# EAGLE design 6502_C64_with_6526 (EAGLE 9.2.0)
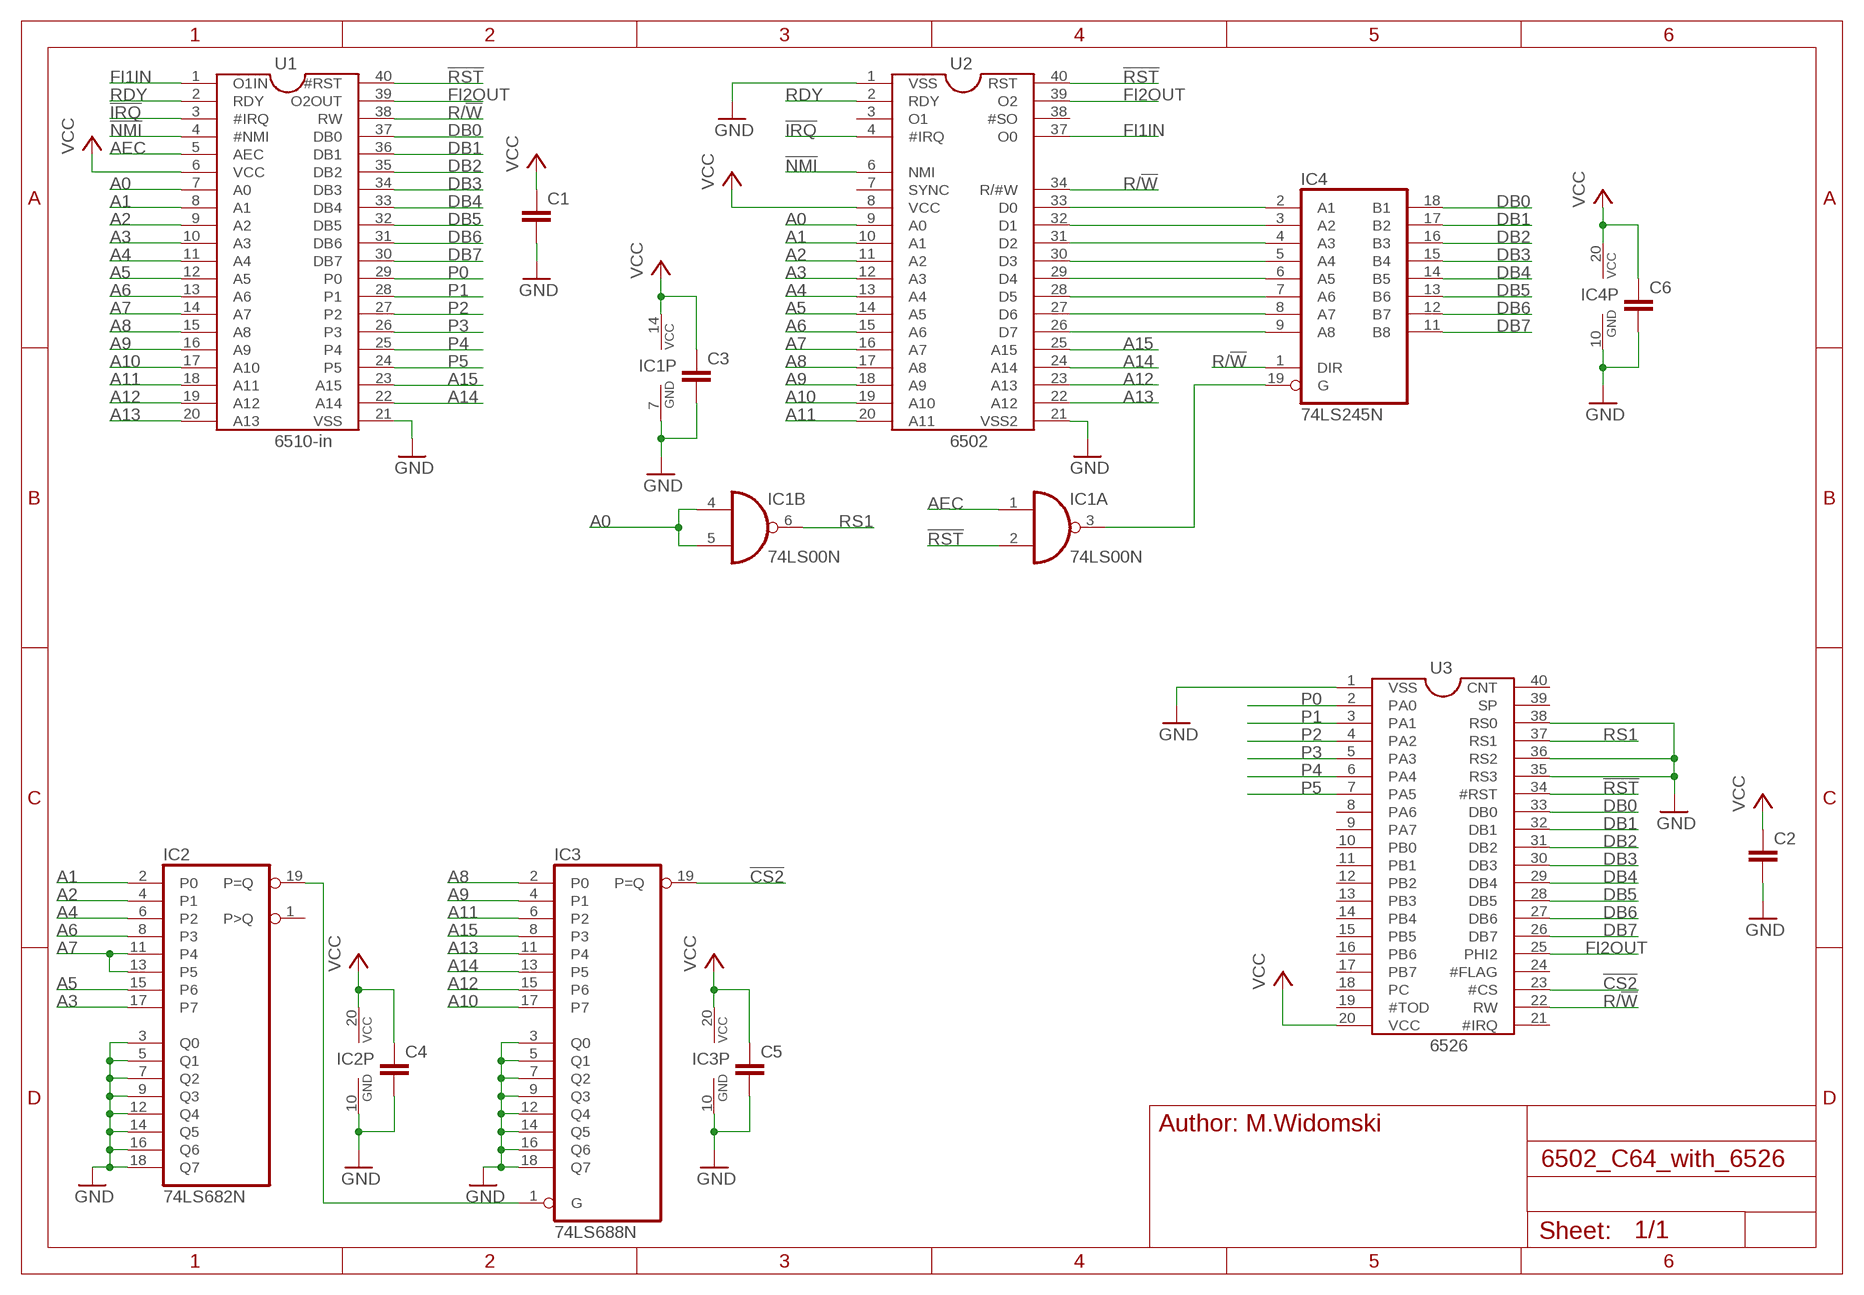
[diagram p0: schematic, sheet 1]

## Parts
C1  C-EU025-025X050  [C025-025X050]
C2  C-EU025-025X050  [C025-025X050]
C3  C-EU025-025X050  [C025-025X050]
C4  C-EU025-025X050  [C025-025X050]
C5  C-EU025-025X050  [C025-025X050]
C6  C-EU025-025X050  [C025-025X050]
IC1  74LS00N  [DIL14]
IC2  74LS682N  [DIL20]
IC3  74LS688N  [DIL20]
IC4  74LS245N  [DIL20]
U1  6510-in  6510  [DIL40]
U2  6502  [DIL40]
U3  6526  [DIL40]

## Nets
!CS2: IC3.19(P=Q) U3.23(#CS)
!IRQ: U1.3(#IRQ) U2.4(#IRQ)
!NMI: U1.4(#NMI) U2.6(NMI)
!RST: IC1.2(A:I1) U1.40(#RST) U2.40(RST) U3.34(#RST)
A0: IC1.4(B:I0) IC1.5(B:I1) U1.7(A0) U2.9(A0)
A1: IC2.2(P0) U1.8(A1) U2.10(A1)
A2: IC2.4(P1) U1.9(A2) U2.11(A2)
A3: IC2.17(P7) U1.10(A3) U2.12(A3)
A4: IC2.6(P2) U1.11(A4) U2.13(A4)
A5: IC2.15(P6) U1.12(A5) U2.14(A5)
A6: IC2.8(P3) U1.13(A6) U2.15(A6)
A7: IC2.11(P4) IC2.13(P5) U1.14(A7) U2.16(A7)
A8: IC3.2(P0) U1.15(A8) U2.17(A8)
A9: IC3.4(P1) U1.16(A9) U2.18(A9)
A10: IC3.17(P7) U1.17(A10) U2.19(A10)
A11: IC3.6(P2) U1.18(A11) U2.20(A11)
A12: IC3.15(P6) U1.19(A12) U2.23(A13)
A13: IC3.11(P4) U1.20(A13) U2.22(A12)
A14: IC3.13(P5) U1.22(A14) U2.24(A14)
A15: IC3.8(P3) U1.23(A15) U2.25(A15)
AEC: IC1.1(A:I0) U1.5(AEC)
DB0: IC4.18(B1) U1.37(DB0) U3.33(DB0)
DB1: IC4.17(B2) U1.36(DB1) U3.32(DB1)
DB2: IC4.16(B3) U1.35(DB2) U3.31(DB2)
DB3: IC4.15(B4) U1.34(DB3) U3.30(DB3)
DB4: IC4.14(B5) U1.33(DB4) U3.29(DB4)
DB5: IC4.13(B6) U1.32(DB5) U3.28(DB5)
DB6: IC4.12(B7) U1.31(DB6) U3.27(DB6)
DB7: IC4.11(B8) U1.30(DB7) U3.26(DB7)
FI1IN: U1.1(O1IN) U2.37(O0)
FI2OUT: U1.39(O2OUT) U2.39(O2) U3.25(PHI2)
GND: C1.2 C2.2 C3.2 C4.2 C5.2 C6.2 IC1.7(P:GND) IC2.3(Q0) IC2.5(Q1) IC2.7(Q2) IC2.9(Q3) IC2.10(GND) IC2.12(Q4) IC2.14(Q5) IC2.16(Q6) IC2.18(Q7) IC3.3(Q0) IC3.5(Q1) IC3.7(Q2) IC3.9(Q3) IC3.10(GND) IC3.12(Q4) IC3.14(Q5) IC3.16(Q6) IC3.18(Q7) IC4.10(GND) U1.21(VSS) U2.1(VSS) U2.21(VSS2) U3.1(VSS) U3.35(RS3) U3.36(RS2) U3.38(RS0)
N$1: IC4.2(A1) U2.33(D0)
N$2: IC4.3(A2) U2.32(D1)
N$3: IC4.4(A3) U2.31(D2)
N$4: IC4.5(A4) U2.30(D3)
N$5: IC4.6(A5) U2.29(D4)
N$6: IC4.7(A6) U2.28(D5)
N$7: IC4.8(A7) U2.27(D6)
N$8: IC4.9(A8) U2.26(D7)
N$9: IC1.3(A:O) IC4.19(G)
N$10: IC2.19(P=Q) IC3.1(G)
P0: U1.29(P0) U3.2(PA0)
P1: U1.28(P1) U3.3(PA1)
P2: U1.27(P2) U3.4(PA2)
P3: U1.26(P3) U3.5(PA3)
P4: U1.25(P4) U3.6(PA4)
P5: U1.24(P5) U3.7(PA5)
R/!W: IC4.1(DIR) U1.38(RW) U2.34(R/#W) U3.22(RW)
RDY: U1.2(RDY) U2.2(RDY)
RS1: IC1.6(B:O) U3.37(RS1)
VCC: C1.1 C2.1 C3.1 C4.1 C5.1 C6.1 IC1.14(P:VCC) IC2.20(VCC) IC3.20(VCC) IC4.20(VCC) U1.6(VCC) U2.8(VCC) U3.20(VCC)
Unconnected: IC1.8(C:O) IC1.9(C:I0) IC1.10(C:I1) IC1.11(D:O) IC1.12(D:I0) IC1.13(D:I1) IC2.1(P>Q) U2.3(O1) U2.7(SYNC) U2.38(#SO) U3.8(PA6) U3.9(PA7) U3.10(PB0) U3.11(PB1) U3.12(PB2) U3.13(PB3) U3.14(PB4) U3.15(PB5) U3.16(PB6) U3.17(PB7) U3.18(PC) U3.19(#TOD) U3.21(#IRQ) U3.24(#FLAG) U3.39(SP) U3.40(CNT)

## Notes on the sheet
- Author: M.Widomski

## Library data of the parts
C1-C6 = rcl:C-EU: CAPACITOR, European symbol; SPICEPREFIX: C
IC1 = 74xx-eu:74*00: Quad 2-input NAND gate
IC2 = 74xx-eu:74*682: 8-bit MAGNITUDE/IDENTITY COMPARATOR, totem pole
IC3 = 74xx-eu:74*688: 8-bit MAGNITUDE/IDENTITY COMPARATOR, totem pole
IC4 = 74xx-eu:74*245: Octal BUS TRANSCEIVER, 3-state
U1 = commodore:6510: The famous 6510 CPU. There are some differences between the 6510, 6510-1 and the 6510-2. The -1 and -2 versions have a slightly changed pinout and 2 IO-bits more than the 6510!
U2 = commodore:6502: 6502 MPU * DIP40 package * 65k addressable bytes of memory (A0-A15) * #IRQ and #NMI interrupts * On-Chip clock with TTL single phase input, RC and crystal time base input * Two Phase Clock output * SYNC-Signal * RDY-Signal Information is taken from "Commodore Semiconductor Group - NMOS 6502 MICROPROCESSORS NOVEMBER 1985".
U3 = commodore:6526: Complex Interface Adapter

## Board
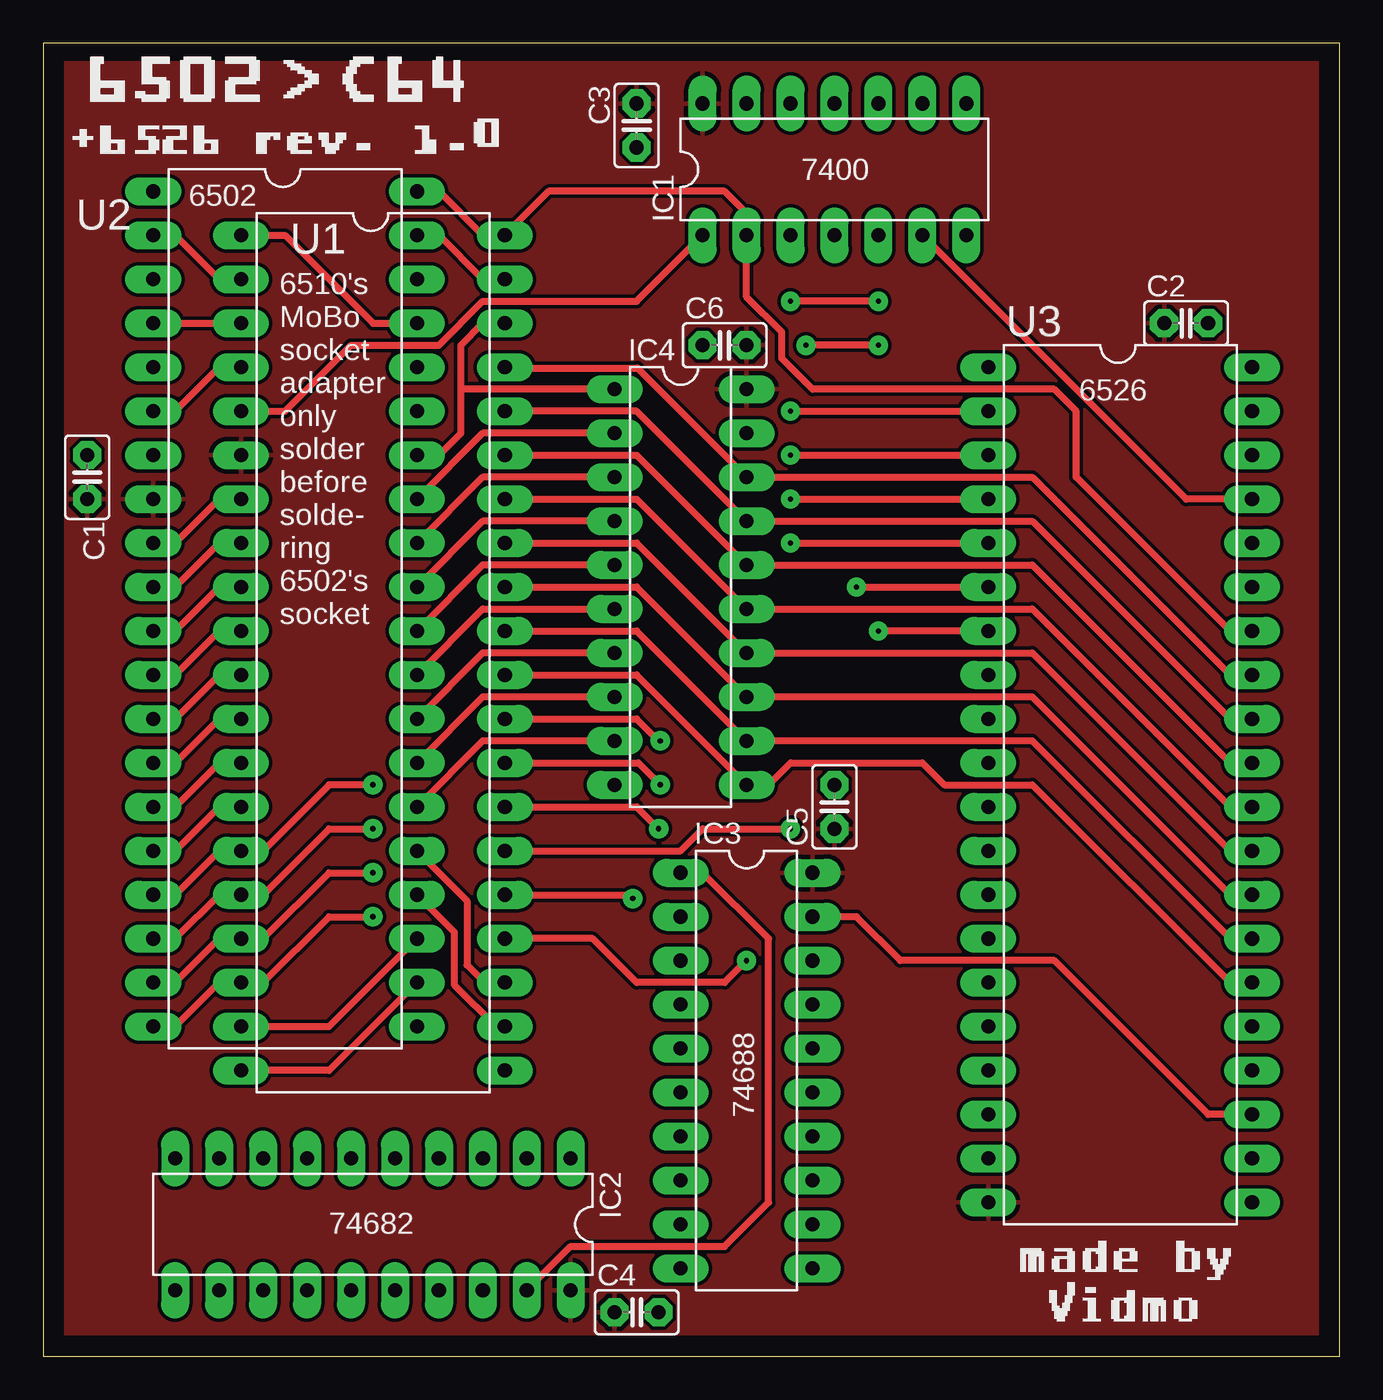
[diagram p1: board, top side]
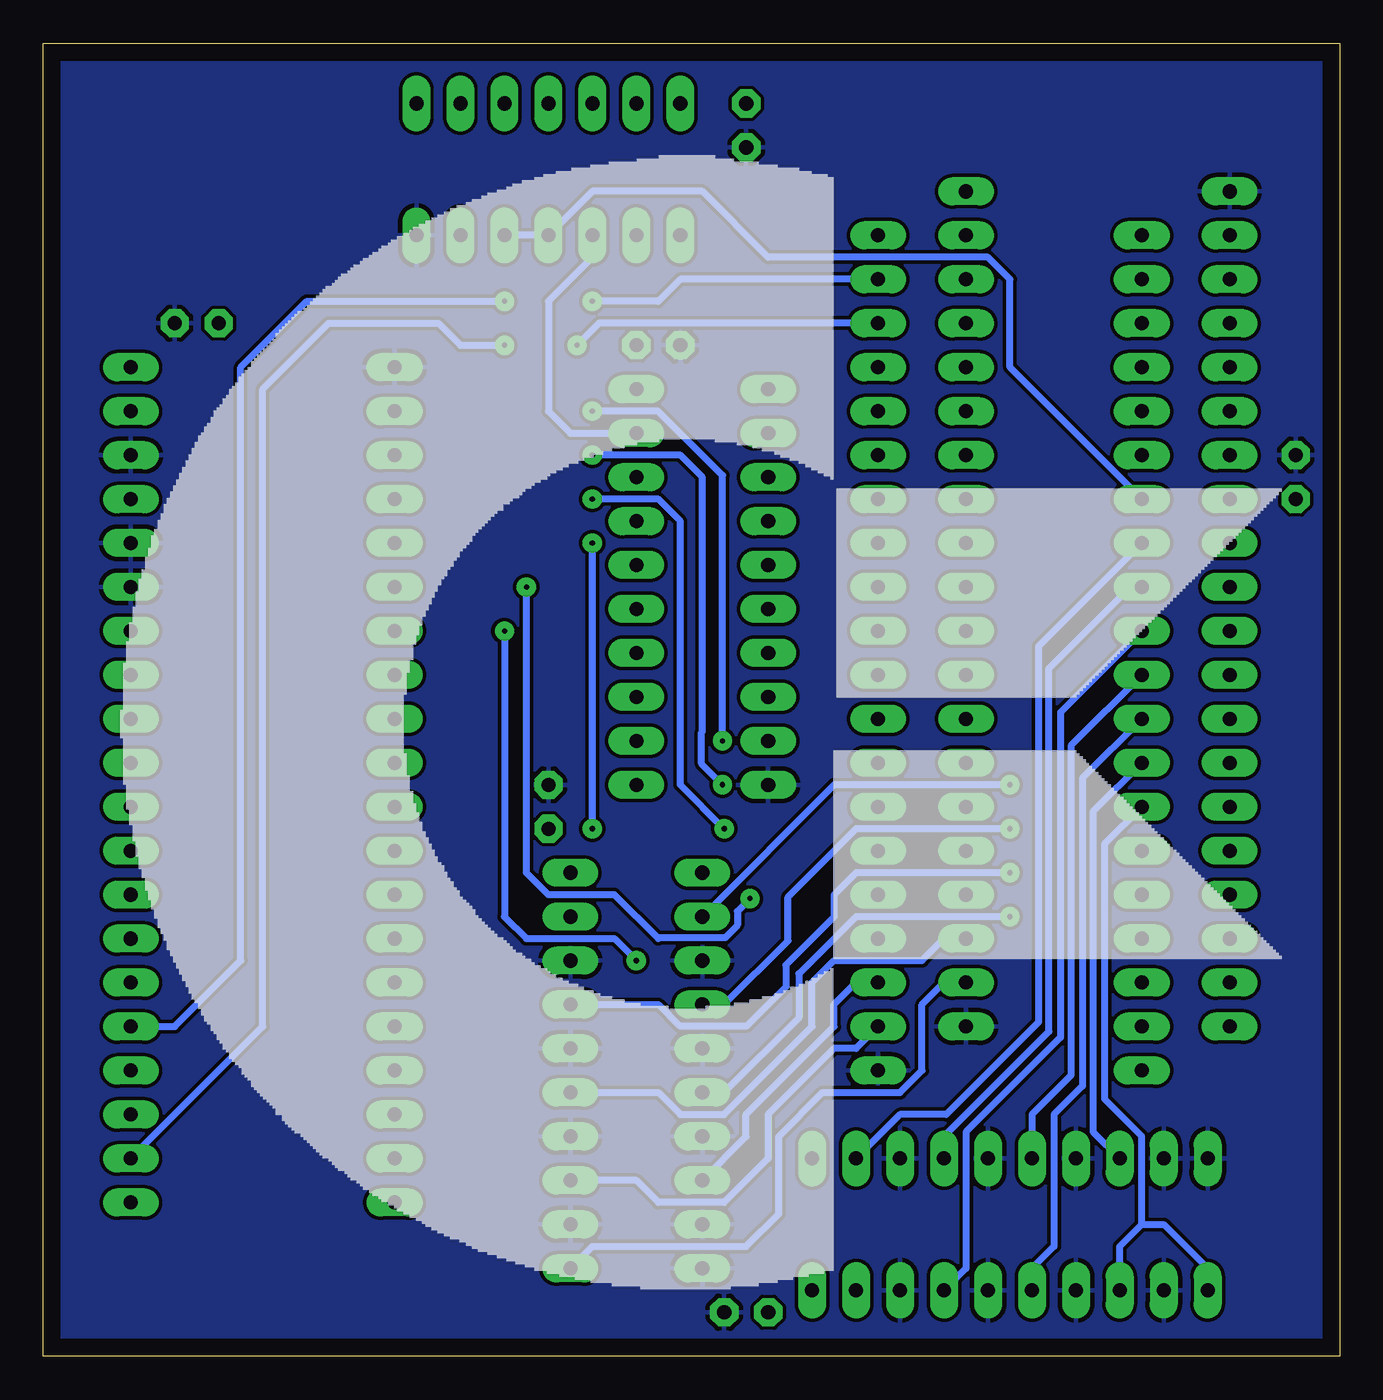
[diagram p2: board, bottom side, seen from below]

Size 74.91 x 75.87 mm. Coordinates in mm from the lower left corner, seen from the top.
Outline: 0,0 74.91,0 74.91,75.87 0,75.87 0,0
Copper layers (1*16): Top 0.035mm / dielectric 1.5mm / Bottom 0.035mm
Design rules "default *": minimum track width 16mil, minimum drill 0.3mm, track to track 8mil, track to pad 8mil, pad to pad 8mil, via to via 8mil, smd to smd 8mil, copper to edge 40mil, drill to drill 16mil, minimum pad ring 16mil, minimum via ring 16mil, stop-mask expansion 4mil, vias tented up to drill 0.35mm, thermal gap 10mil

### Footprints (pad centres in the part's own frame; a part is rotated, then mirrored left to right if it is on the bottom)
C025-025X050 = drill 0.813 octagon: 1 -1.27,0; 2 1.27,0
DIL14 = drill 0.813 long: 1 -7.62,-3.81; 2 -5.08,-3.81; 3 -2.54,-3.81; 4 0,-3.81; 5 2.54,-3.81; 6 5.08,-3.81; 7 7.62,-3.81; 8 7.62,3.81; 9 5.08,3.81; 10 2.54,3.81; 11 0,3.81; 12 -2.54,3.81; 13 -5.08,3.81; 14 -7.62,3.81
DIL20 = drill 0.813 long: 1 -11.43,-3.81; 2 -8.89,-3.81; 3 -6.35,-3.81; 4 -3.81,-3.81; 5 -1.27,-3.81; 6 1.27,-3.81; 7 3.81,-3.81; 8 6.35,-3.81; 9 8.89,-3.81; 10 11.43,-3.81; 11 11.43,3.81; 12 8.89,3.81; 13 6.35,3.81; 14 3.81,3.81; 15 1.27,3.81; 16 -1.27,3.81; 17 -3.81,3.81; 18 -6.35,3.81; 19 -8.89,3.81; 20 -11.43,3.81
DIL40 = drill 0.813 long: 1 -24.13,-7.62; 2 -21.59,-7.62; 3 -19.05,-7.62; 4 -16.51,-7.62; 5 -13.97,-7.62; 6 -11.43,-7.62; 7 -8.89,-7.62; 8 -6.35,-7.62; 9 -3.81,-7.62; 10 -1.27,-7.62; 11 1.27,-7.62; 12 3.81,-7.62; 13 6.35,-7.62; 14 8.89,-7.62; 15 11.43,-7.62; 16 13.97,-7.62; 17 16.51,-7.62; 18 19.05,-7.62; 19 21.59,-7.62; 20 24.13,-7.62; 21 24.13,7.62; 22 21.59,7.62; 23 19.05,7.62; 24 16.51,7.62; 25 13.97,7.62; 26 11.43,7.62; 27 8.89,7.62; 28 6.35,7.62; 29 3.81,7.62; 30 1.27,7.62; 31 -1.27,7.62; 32 -3.81,7.62; 33 -6.35,7.62; 34 -8.89,7.62; 35 -11.43,7.62; 36 -13.97,7.62; 37 -16.51,7.62; 38 -19.05,7.62; 39 -21.59,7.62; 40 -24.13,7.62

### Placement (x,y rotation side)
C1  2.54,50.8 90 top
C2  66.04,59.69 0 top
C3  34.29,71.12 270 top
C4  34.29,2.54 0 top
C5  45.72,31.75 90 top
C6  39.37,58.42 180 top
IC1  45.72,68.58 0 top
IC2  19.05,7.62 180 top
IC3  40.64,16.51 270 top
IC4  36.83,44.45 270 top
U1  19.05,40.64 270 top
U2  13.97,43.18 270 top
U3  62.23,33.02 270 top

### Tracks (layer width: path | path; a pad name or v marks a point on that pad's centre or on a via)
!CS2
  Top 0.406: IC3.19 46.99,25.4 49.53,22.86 58.42,22.86 67.31,13.97 U3.23
!IRQ
  Top 0.406: U2.4 U1.3
!NMI
  Top 0.406: U2.6 7.62,54.61 10.16,57.15 U1.4
!RST
  Top 0.406: U2.40 22.86,67.31 25.4,64.77 U1.40 29.21,67.31 39.37,67.31 40.64,66.04 IC1.2 40.64,61.21 42.67,59.18 42.67,57.66 44.45,55.88 58.42,55.88 59.69,54.61 59.69,50.8 68.58,41.91 U3.34
A0
  Top 0.406: U2.9 7.62,46.99 10.16,49.53 U1.7
  Bottom 0.406: U1.7 19.05,57.15 19.05,62.23 20.32,63.5 33.02,63.5 36.83,67.31 43.18,67.31 IC1.4 IC1.5
A1
  Top 0.406: U2.10 7.62,44.45 10.16,46.99 U1.8
  Bottom 0.406: U1.8 17.4,41.02 17.4,19.3 22.73,13.97 25.4,13.97 IC2.2
A2
  Top 0.406: U2.11 7.62,41.91 10.16,44.45 U1.9
  Bottom 0.406: IC2.4 22.86,12.7 16.79,18.77 16.79,39.75 12.09,44.45 U1.9
A3
  Top 0.406: U1.10 10.16,41.91 7.62,39.37 U2.12
  Bottom 0.406: U1.10 16.13,37.21 16.13,18.41 21.59,12.95 21.59,5.08 IC2.17
A4
  Top 0.406: U1.11 10.16,39.37 7.62,36.83 U2.13
  Bottom 0.406: U1.11 15.52,35.28 15.52,16.23 17.78,13.97 IC2.6
A5
  Top 0.406: U2.14 7.62,34.29 10.16,36.83 U1.12
  Bottom 0.406: U1.12 14.86,33.4 14.86,15.62 16.51,13.97 16.51,6.35 17.78,5.08 IC2.15
A6
  Top 0.406: U2.15 7.62,31.75 10.16,34.29 U1.13
  Bottom 0.406: U1.13 14.25,31.47 14.25,12.98 IC2.8
A7
  Top 0.406: U2.16 7.62,29.21 10.16,31.75 U1.14
  Bottom 0.406: U1.14 13.59,29.59 13.59,14.86 11.43,12.7 11.43,7.62 | IC2.13 12.7,6.35 11.43,7.62 | 11.43,7.62 10.16,7.62 7.62,5.08 IC2.11
A8  (via drill 0.3)
  Top 0.406: U2.17 7.62,26.67 10.16,29.21 U1.15 12.7,29.21 16.51,33.02 v19.05,33.02
  Bottom 0.406: v19.05,33.02 29.21,33.02 IC3.2
A9  (via drill 0.3)
  Top 0.406: U2.18 7.62,24.13 10.16,26.67 U1.16 12.7,26.67 16.51,30.48 v19.05,30.48
  Bottom 0.406: IC3.4 35.56,20.32 31.88,24 31.88,26.54 27.94,30.48 v19.05,30.48
A10  (via drill 0.3)
  Top 0.406: U2.19 7.62,21.59 10.16,24.13 U1.17 12.7,24.13 16.51,27.94 v19.05,27.94
  Bottom 0.406: IC3.17 39.37,20.32 38.15,19.1 34.24,19.1 32,21.34 32,22.61 29.21,25.4 29.21,26.67 27.94,27.94 v19.05,27.94
A11  (via drill 0.3)
  Top 0.406: U2.20 7.62,19.05 10.16,21.59 U1.18 12.7,21.59 16.51,25.4 v19.05,25.4
  Bottom 0.406: v19.05,25.4 27.94,25.4 31.24,22.1 31.24,19.56 35.56,15.24 IC3.6
A12
  Top 0.406: U1.19 16.51,19.05 U2.23
  Bottom 0.406: IC3.15 39.37,15.24 38.1,13.97 35.56,13.97 30.48,19.05 30.48,21.59 29.21,22.86 24.13,22.86 22.86,24.13 U2.23
A13
  Top 0.406: U2.22 16.51,16.51 U1.20
  Bottom 0.406: IC3.11 43.18,6.35 34.29,6.35 32.41,8.23 32.41,12.7 29.87,15.24 25.4,15.24 24.13,16.51 24.13,20.32 22.86,21.59 U2.22
A14
  Top 0.406: U2.24 23.75,24.51 23.75,21.46 26.16,19.05 U1.22
  Bottom 0.406: U1.22 27.94,17.78 29.21,17.78 33.02,13.97 33.02,11.43 35.56,8.89 39.37,8.89 40.64,10.16 IC3.13
A15
  Top 0.406: U2.25 24.49,26.31 24.49,22.61 25.5,21.59 U1.23
  Bottom 0.406: IC3.8 34.29,12.7 34.29,13.97 29.21,19.05 29.21,20.32 27.94,21.59 U1.23
AEC
  Top 0.406: U1.5 13.97,54.61 17.78,58.42 22.86,58.42 25.4,60.96 34.29,60.96 IC1.1
DB0
  Top 0.406: U1.37 26.72,57.1 34.34,57.1 IC4.18 57.15,50.8 68.58,39.37 U3.33
DB1
  Top 0.406: U1.36 34.29,54.61 IC4.17 57.15,48.26 68.58,36.83 U3.32
DB2
  Top 0.406: U1.35 34.29,52.07 IC4.16 57.15,45.72 68.58,34.29 U3.31
DB3
  Top 0.406: U1.34 34.29,49.53 IC4.15 57.15,43.18 68.58,31.75 U3.30
DB4
  Top 0.406: U1.33 34.29,46.99 IC4.14 57.15,40.64 68.58,29.21 U3.29
DB5
  Top 0.406: U1.32 34.29,44.45 IC4.13 57.15,38.1 68.58,26.67 U3.28
DB6
  Top 0.406: U1.31 34.29,41.91 IC4.12 57.15,35.56 68.58,24.13 U3.27
DB7
  Top 0.406: U1.30 34.29,39.37 IC4.11 41.91,33.02 43.18,34.29 50.8,34.29 52.07,33.02 57.15,33.02 68.58,21.59 U3.26
FI1IN
  Top 0.406: U1.1 13.97,64.77 19.05,59.69 U2.37
FI2OUT  (via drill 0.3)
  Top 0.406: U2.39 22.86,64.77 25.4,62.23 U1.39 | v48.26,60.96 v43.18,60.96
  Bottom 0.406: U1.39 38.1,62.23 39.37,60.96 v43.18,60.96 | U3.25 67.31,19.05 63.5,22.86 63.5,57.15 59.69,60.96 v48.26,60.96
GND
  pour Bottom: -1.27,-1.27 76.2,-1.27 76.2,76.2 -1.27,76.2
N$1
  Top 0.406: IC4.2 25.4,53.34 U2.33
N$2
  Top 0.406: IC4.3 25.4,50.8 U2.32
N$3
  Top 0.406: IC4.4 25.4,48.26 U2.31
N$4
  Top 0.406: IC4.5 25.4,45.72 U2.30
N$5
  Top 0.406: U2.29 25.4,43.18 IC4.6
N$6
  Top 0.406: IC4.7 25.4,40.64 U2.28
N$7
  Top 0.406: U2.27 25.4,38.1 IC4.8
N$8
  Top 0.406: IC4.9 25.4,35.56 U2.26
N$9
  Bottom 0.406: IC1.3 43.18,63.5 45.72,60.96 45.72,54.61 44.45,53.34 IC4.19
N$10
  Top 0.406: IC2.19 30.48,6.35 39.37,6.35 41.91,8.89 41.91,24.13 38.1,27.94 IC3.1
P0  (via drill 0.3)
  Top 0.406: U1.29 34.29,36.83 35.56,35.56 v35.66,35.56 | v43.18,54.61 U3.2
  Bottom 0.406: v35.66,35.56 35.66,50.89 39.37,54.61 v43.18,54.61
P1  (via drill 0.3)
  Top 0.406: v35.66,33.02 34.38,34.29 U1.28 | v43.18,52.07 U3.3
  Bottom 0.406: v35.66,33.02 36.87,34.23 36.87,36.06 36.83,36.1 36.83,50.8 38.1,52.07 v43.18,52.07
P2  (via drill 0.3)
  Top 0.406: U1.27 34.29,31.75 v35.56,30.48 | v43.18,49.53 U3.4
  Bottom 0.406: v35.56,30.48 38.1,33.02 38.1,48.26 39.37,49.53 v43.18,49.53
P3  (via drill 0.3)
  Top 0.406: U1.26 36.83,29.21 38.1,30.48 v43.18,30.48 | v43.18,46.99 U3.5
  Bottom 0.406: v43.18,30.48 v43.18,46.99
P4  (via drill 0.3)
  Top 0.406: U1.25 34.29,26.67 v34.07,26.45 | v46.99,44.45 U3.6
  Bottom 0.406: v34.07,26.45 34.8,25.72 34.8,24.89 35.51,24.18 39.32,24.18 39.37,24.13 41.91,26.67 45.72,26.67 46.99,27.94 v46.99,44.45
P5  (via drill 0.3)
  Top 0.406: v40.64,22.86 39.37,21.59 34.29,21.59 31.75,24.13 U1.24 | U3.7 v48.26,41.91
  Bottom 0.406: v48.26,41.91 48.26,25.4 46.99,24.13 41.91,24.13 v40.64,22.86
R/!W  (via drill 0.3)
  Top 0.406: U2.34 22.86,52.07 24.13,53.34 24.13,55.88 | 24.13,55.88 24.13,58.42 25.4,59.69 U1.38 | IC4.1 24.13,55.88 | v48.26,58.42 v44.07,58.42
  Bottom 0.406: v44.07,58.42 42.8,59.69 U1.38 | U3.22 62.23,19.05 62.23,55.88 58.42,59.69 52.07,59.69 50.8,58.42 v48.26,58.42
RDY
  Top 0.406: U2.2 7.62,64.77 10.16,62.23 U1.2
RS1
  Top 0.406: U3.37 66.04,49.53 IC1.6
VCC
  pour Top: 1.27,74.93 1.27,1.27 73.66,1.27 73.66,74.93

### Text on the board
tNames: 7400 | 6502 | 6526 | 6510's / MoBo / socket / adapter / only / solder / before / solde- / ring / 6502's / socket | 74688 | 74682